# EAGLE schematic 001-STM32F405 (EAGLE 9.6.2)
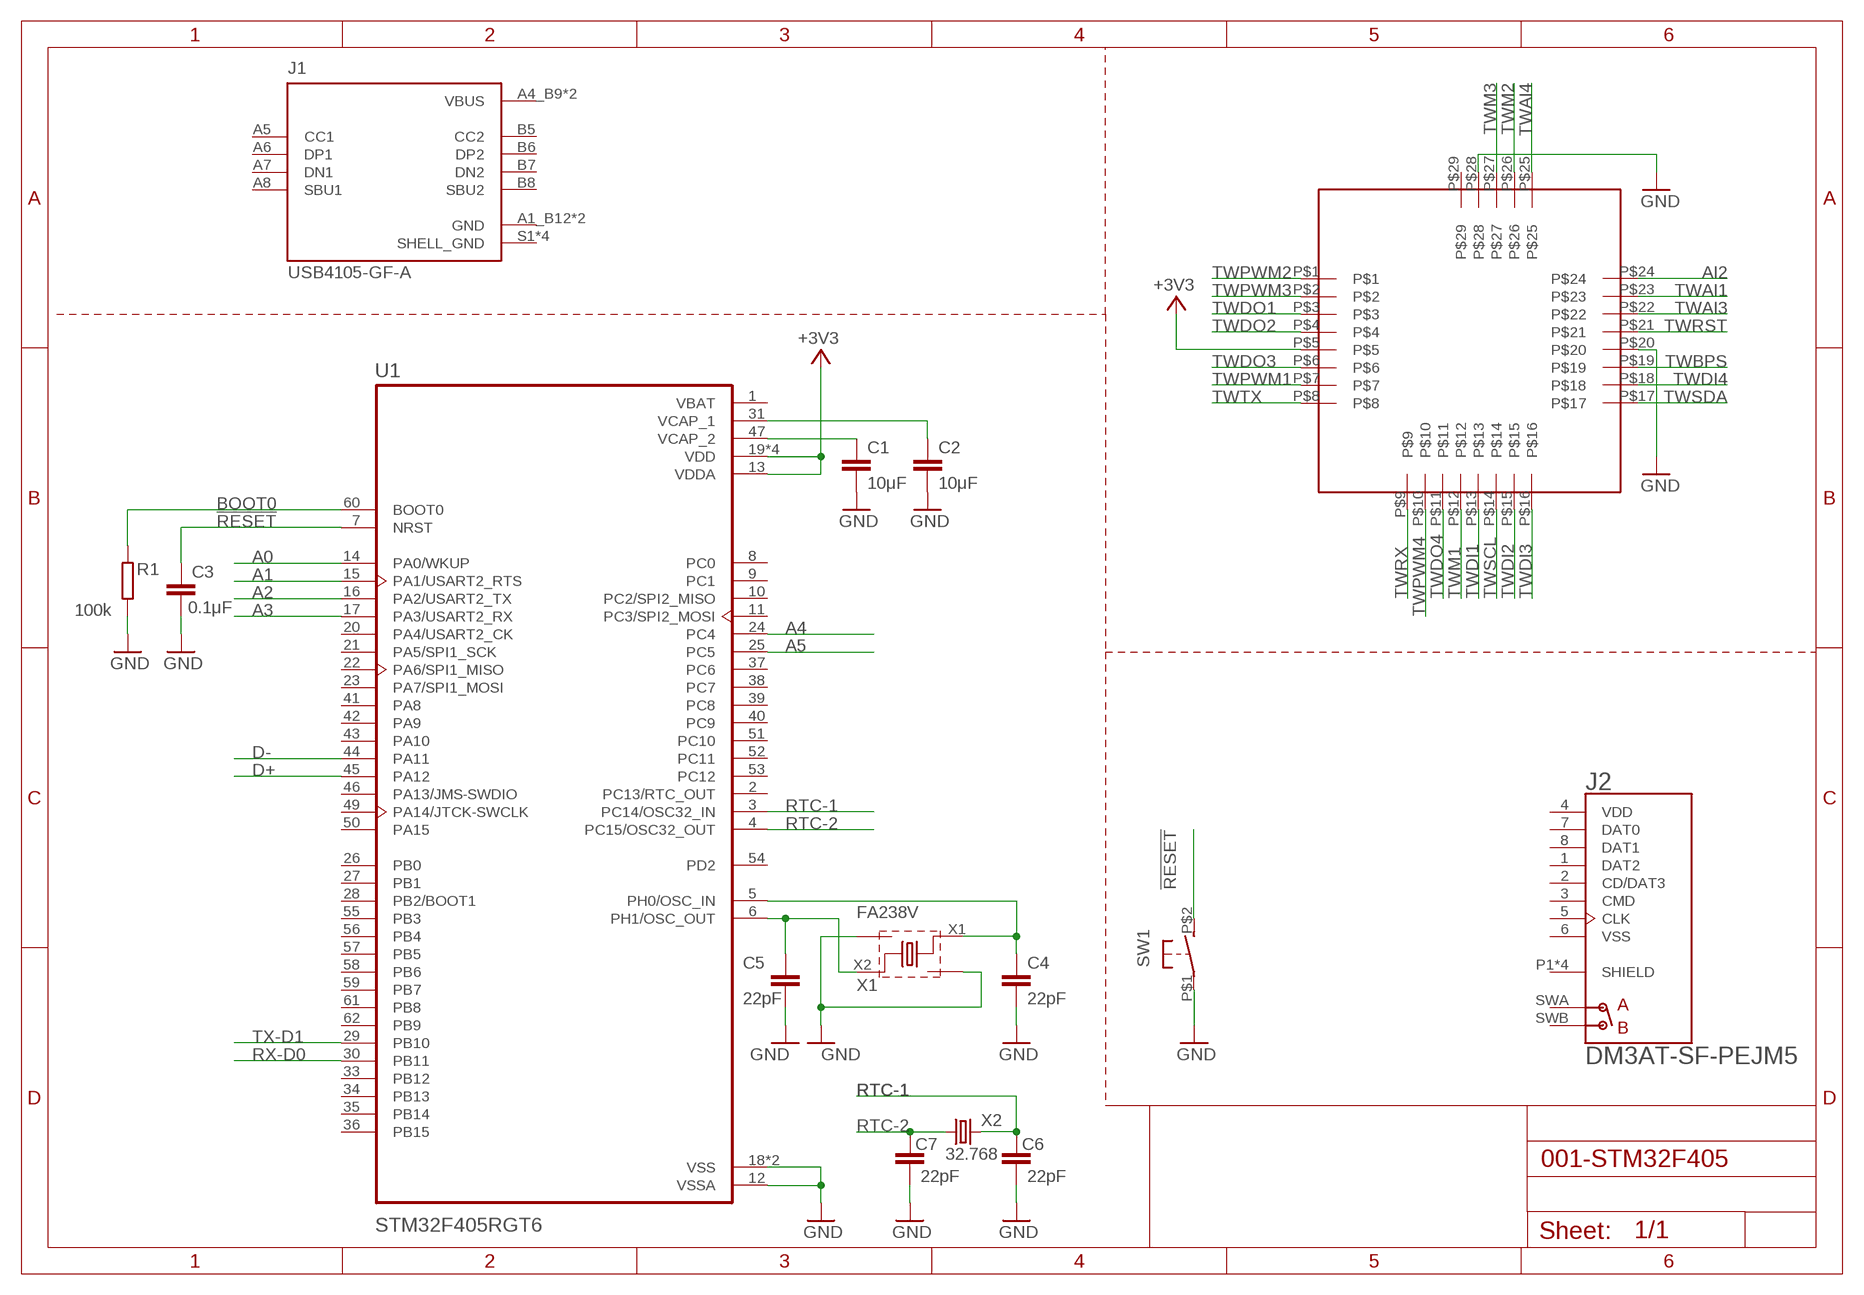
[diagram p0: schematic, sheet 1]

## Parts
C1  10μF  C-EUC1608  [C1608]
C2  10μF  C-EUC1608  [C1608]
C3  0.1μF  C-EUC1608  [C1608]
C4  22pF  C-EUC1608  [C1608]
C5  22pF  C-EUC1608  [C1608]
C6  22pF  C-EUC1608  [C1608]
C7  22pF  C-EUC1608  [C1608]
J1  USB4105-GF-A  [GCT_USB4105-GF-A]
J2  DM3AT-SF-PEJM5  [HRS_DM3AT-SF-PEJM5]
R1  100k  RESISTOR1608  [SMD1608]
SW1  TVAF06-A020B-R  [TVAF06-A020B-R]
U1  STM32F405RGT6  [QFP50P1200X1200X160-64N]
U$1  LITE  [LITE]
X1  FA238V  [FA238V]
X2  32.768  FC-135  [FC-135]

## Nets
!RESET: C3.1 SW1.P$2(S) U1.7(NRST)
+3V3: U1.13(VDDA) U1.19(VDD) U1.32(VDD) U1.48(VDD) U1.64(VDD) U$1.P$5
A0: U1.14(PA0/WKUP)
A1: U1.15(PA1/USART2_RTS)
A2: U1.16(PA2/USART2_TX)
A3: U1.17(PA3/USART2_RX)
A4: U1.24(PC4)
A5: U1.25(PC5)
AI2: U$1.P$24
BOOT0: R1.1 U1.60(BOOT0)
D+: U1.45(PA12)
D-: U1.44(PA11)
GND: C1.2 C2.2 C3.2 C4.2 C5.2 C6.2 C7.2 R1.2 SW1.P$1(P) U1.12(VSSA) U1.18(VSS) U1.63(VSS) U$1.P$20 U$1.P$28 X1.GND X1.GND2(GND1)
N$1: C1.1 U1.47(VCAP_2)
N$2: C2.1 U1.31(VCAP_1)
N$3: C4.1 U1.5(PH0/OSC_IN) X1.X1
N$4: C5.1 U1.6(PH1/OSC_OUT) X1.X2
RTC-1: C6.1 U1.3(PC14/OSC32_IN) X2.P$2
RTC-2: C7.1 U1.4(PC15/OSC32_OUT) X2.P$1
RX-D0: U1.30(PB11)
TWAI1: U$1.P$23
TWAI3: U$1.P$22
TWAI4: U$1.P$25
TWBPS: U$1.P$19
TWDI1: U$1.P$13
TWDI2: U$1.P$15
TWDI3: U$1.P$16
TWDI4: U$1.P$18
TWDO1: U$1.P$3
TWDO2: U$1.P$4
TWDO3: U$1.P$6
TWDO4: U$1.P$11
TWM1: U$1.P$12
TWM2: U$1.P$26
TWM3: U$1.P$27
TWPWM1: U$1.P$7
TWPWM2: U$1.P$1
TWPWM3: U$1.P$2
TWPWM4: U$1.P$10
TWRST: U$1.P$21
TWRX: U$1.P$9
TWSCL: U$1.P$14
TWSDA: U$1.P$17
TWTX: U$1.P$8
TX-D1: U1.29(PB10)
Unconnected: J1.A5(CC1) J1.A6(DP1) J1.A7(DN1) J1.A8(SBU1) J1.B5(CC2) J1.B6(DP2) J1.B7(DN2) J1.B8(SBU2) J2.1(DAT2) J2.2(CD/DAT3) J2.3(CMD) J2.5(CLK) J2.7(DAT0) J2.8(DAT1) J2.P1(SHIELD) J2.P2(SHIELD) J2.P3(SHIELD) J2.P4(SHIELD) J2.SWA(A) J2.SWB(B) U1.2(PC13/RTC_OUT) U1.8(PC0) U1.9(PC1) U1.10(PC2/SPI2_MISO) U1.11(PC3/SPI2_MOSI) U1.20(PA4/USART2_CK) U1.21(PA5/SPI1_SCK) U1.22(PA6/SPI1_MISO) U1.23(PA7/SPI1_MOSI) U1.26(PB0) U1.27(PB1) U1.28(PB2/BOOT1) U1.33(PB12) U1.34(PB13) U1.35(PB14) U1.36(PB15) U1.37(PC6) U1.38(PC7) U1.39(PC8) U1.40(PC9) U1.41(PA8) U1.42(PA9) U1.43(PA10) U1.46(PA13/JMS-SWDIO) U1.49(PA14/JTCK-SWCLK) U1.50(PA15) U1.51(PC10) U1.52(PC11) U1.53(PC12) U1.54(PD2) U1.55(PB3) U1.56(PB4) U1.57(PB5) U1.58(PB6) U1.59(PB7) U1.61(PB8) U1.62(PB9) U$1.P$29

## Power pins joined to a net without a drawn wire
GND: J1.A1_B12(GND) J1.B1_A12(GND)
SHELL_GND: J1.S1(SHELL_GND) J1.S2(SHELL_GND) J1.S3(SHELL_GND) J1.S4(SHELL_GND)
VBAT: U1.1(VBAT)
VBUS: J1.A4_B9(VBUS) J1.B4_A9(VBUS)
VDD: J2.4(VDD)
VSS: J2.6(VSS)

## Library data of the parts
C1-C7 = rcl:C-EU: CAPACITOR, European symbol; SPICEPREFIX: C
J1 = USB4105-GF-A:USB4105-GF-A: USB-C (USB TYPE-C) USB 2.0 Receptacle Connector 24 (16+8 Dummy) Position Surface Mount, Right Angle; Through Hole Check prices <https://pricing.snapeda.com/parts/USB4105-GF-A/GCT/view-part?ref=eda>; AVAILABILITY: Warning; DESCRIPTION: USB-C (USB TYPE-C) USB 2.0 Receptacle Connector 24 (16+8 Dummy) Position Surface Mount, Right Angle; Through Hole; MF: GCT; MP: USB4105-GF-A; PACKAGE: None; PRICE: None; PURCHASE-URL: https://pricing.snapeda.com/search/part/USB4105-GF-A/?ref=eda
J2 = DM3AT-SF-PEJM5:DM3AT-SF-PEJM5: DM3 Series 8 Position Right Angle SMT Push Push Ejection MicroSD Card Connector Check prices <https://pricing.snapeda.com/parts/DM3AT-SF-PEJM5/Hirose/view-part?ref=eda>; AVAILABILITY: Warning; DESCRIPTION: 10 (8 + 2) Position Card Connector Secure Digital - microSD™ Surface Mount, Right Angle Gold; MF: Hirose; MP: DM3AT-SF-PEJM5; PACKAGE: None; PRICE: None; PURCHASE-URL: https://pricing.snapeda.com/search/part/DM3AT-SF-PEJM5/?ref=eda
R1 = generic:RESISTOR: Generic Registor
SW1 = Shirokuma-89-SWITCH:TVAF06-A020B-R
U1 = STM32F405RGT6:STM32F405RGT6: High-performance foundation line, ARM Cortex-M4 core with DSP and FPU, 1 Mbyte Flash, 168 MHz CPU, ART Accelerator Check prices <https://pricing.snapeda.com/parts/STM32F405RGT6/STMicroelectronics/view-part?ref=eda>; AVAILABILITY: Warning; DESCRIPTION: ARM® Cortex®-M4 STM32F4 Microcontroller IC 32-Bit 168MHz 1MB (1M x 8) FLASH 64-LQFP (10x10); MF: STMicroelectronics; MP: STM32F405RGT6; PACKAGE: LQFP-64 STMicroelectronics; PRICE: None; PURCHASE-URL: https://pricing.snapeda.com/search/part/STM32F405RGT6/?ref=eda
U$1 = TWELite:LITE
X1 = Shirokuma89-Crystal:FA238V
X2 = Shirokuma89-Crystal:FC-135